# EAGLE design blinker-v2 (EAGLE 9.6.2)
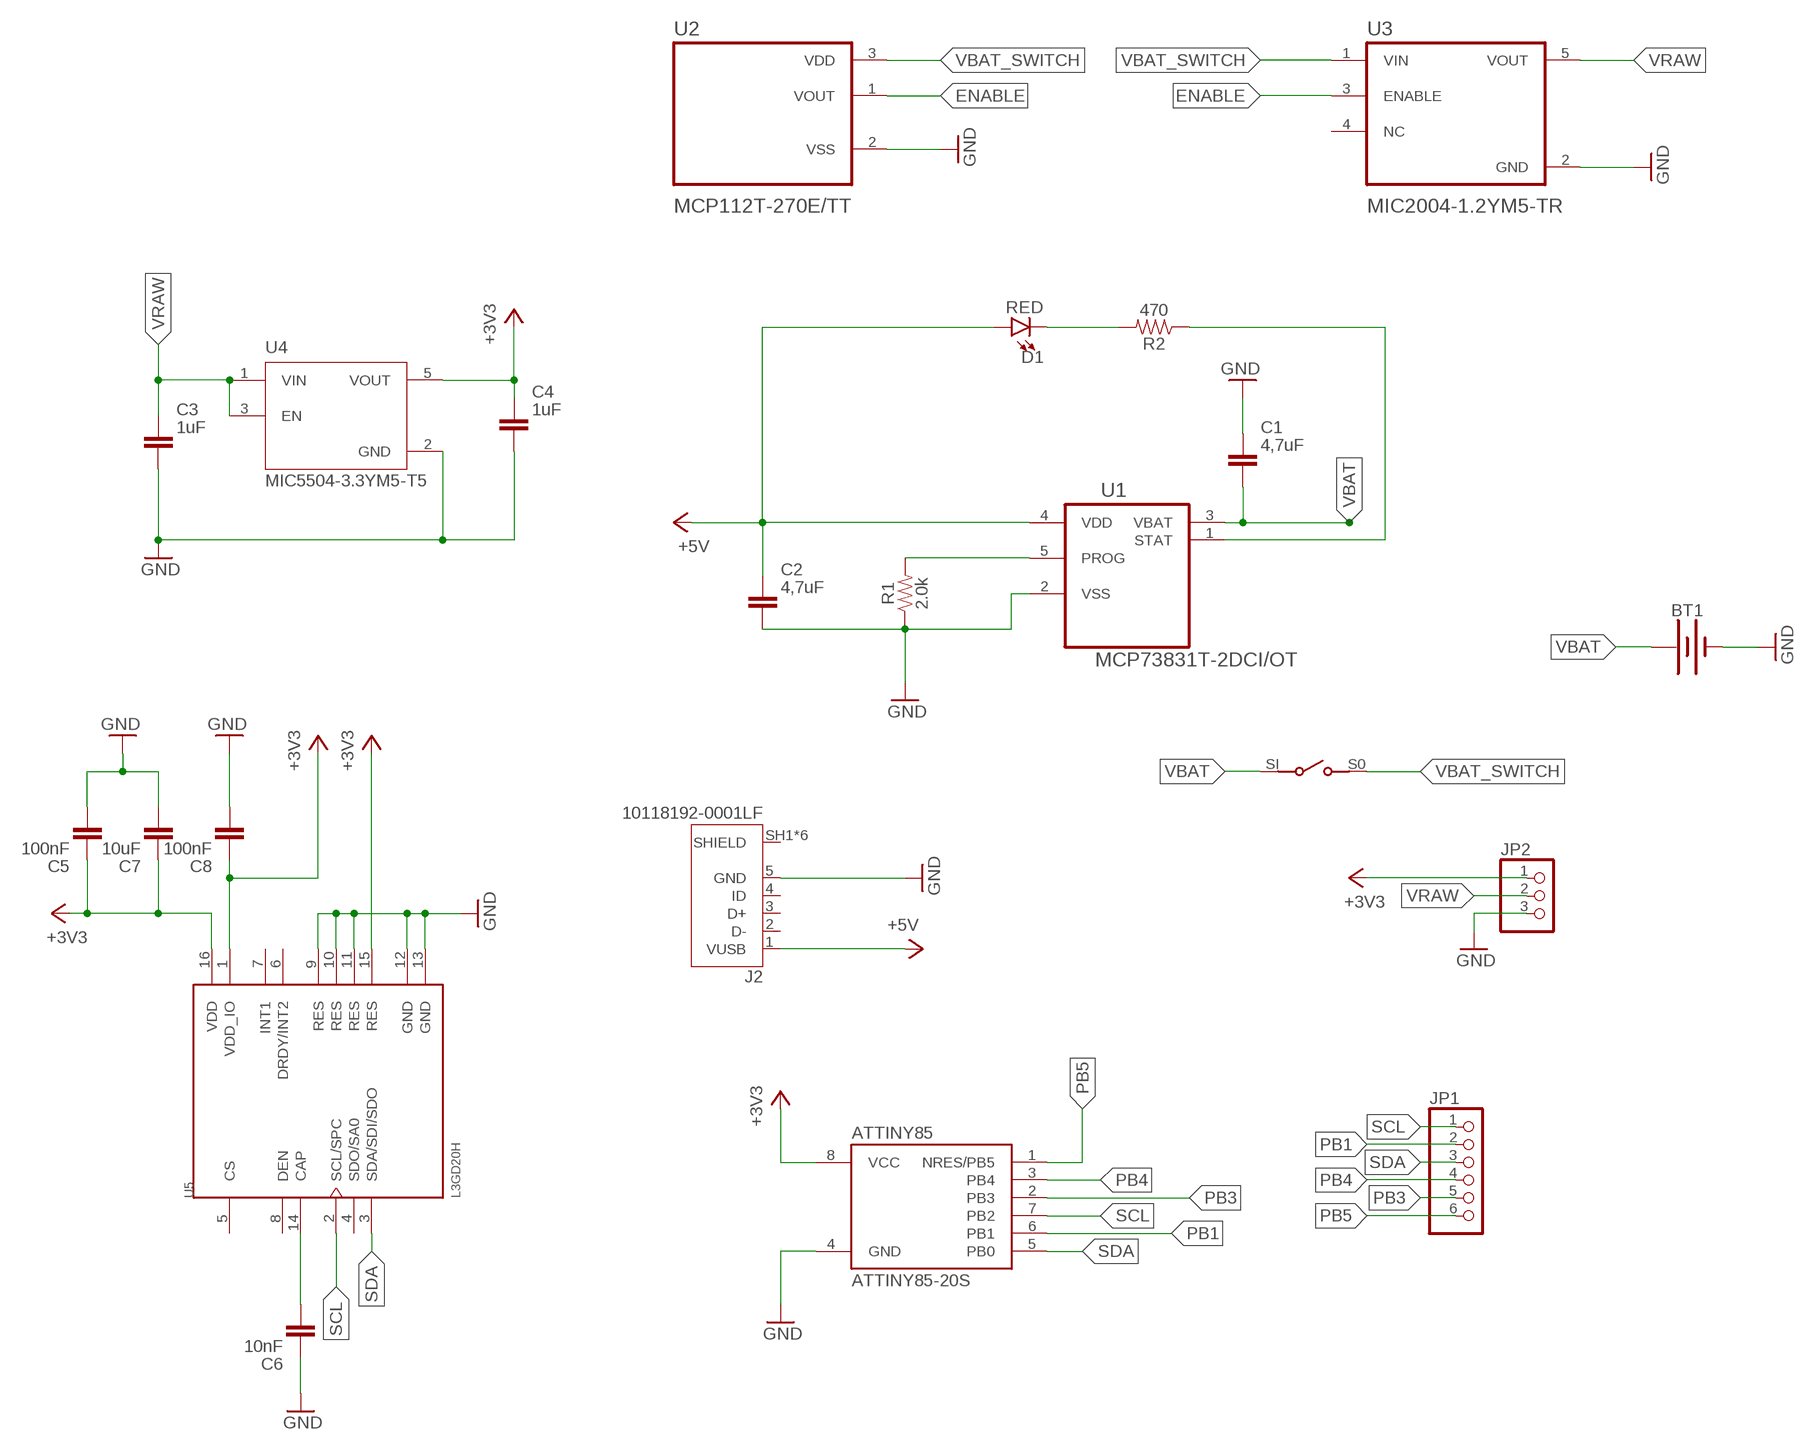
[diagram p0: schematic, sheet 1]

## Parts
ATTINY85  ATTINY85-20S  [SOIC8_EIAJ_208MIL]
BT1  BATTERY-20MM_SMD  [BATTCON_20MM]
C1  4,7uF  C_CHIP-1206(3216-METRIC)  [CAPC3216X135]
C2  4,7uF  C_CHIP-1206(3216-METRIC)  [CAPC3216X135]
C3  1uF  C_CHIP-1206(3216-METRIC)  [CAPC3216X135]
C4  1uF  C_CHIP-1206(3216-METRIC)  [CAPC3216X135]
C5  100nF  C_CHIP-1206(3216-METRIC)  [CAPC3216X135]
C6  10nF  C_CHIP-1206(3216-METRIC)  [CAPC3216X135]
C7  10uF  C_CHIP-1206(3216-METRIC)  [CAPC3216X135]
C8  100nF  C_CHIP-1206(3216-METRIC)  [CAPC3216X135]
D1  RED  LED-RED0603  [LED-0603]
J2  10118192-0001LF  [AMPHENOL_10118192-0001LF]
JP1  PINHD-1X6  [1X06]
JP2  PINHD-1X3  [1X03]
R1  2.0k  2.0KOHM-0603-1/10W-5%  [0603]
R2  470  470OHM-0603-1/10W-1%  [0603]
U1  MCP73831T-2DCI/OT  [SOT95P270X145-5N]
U2  MCP112T-270E/TT  [SOT95P237X112-3N]
U3  MIC2004-1.2YM5-TR  [SOT95P280X145-5N]
U4  MIC5504-3.3YM5-T5  [SOT95P280X145-5N]
U5  L3GD20H  [LGA16R50P7X5_300X300X100]
U$1  CHS-01TASMD  [CHS-01TA]

## Nets
+3V3: ATTINY85.8(VCC) C4.1 C5.1 C7.1 C8.1 JP2.1 U4.5(VOUT) U5.1(VDD_IO) U5.15(RES) U5.16(VDD)
+5V: C2.1 D1.A J2.1(VUSB) U1.4(VDD)
ENABLE: U2.1(VOUT) U3.3(ENABLE)
GND: ATTINY85.4(GND) BT1.2(-) C1.1 C2.2 C3.2 C4.2 C5.2 C6.1 C7.2 C8.2 J2.5(GND) JP2.3 R1.1 U1.2(VSS) U2.2(VSS) U3.2(GND) U4.2(GND) U5.9(RES) U5.10(RES) U5.11(RES) U5.12(GND) U5.13(GND)
N$1: R1.2 U1.5(PROG)
N$2: C6.2 U5.14(CAP)
N$3: D1.C R2.2
N$4: R2.1 U1.1(STAT)
PB1: ATTINY85.6(PB1) JP1.2
PB3: ATTINY85.2(PB3) JP1.5
PB4: ATTINY85.3(PB4) JP1.4
PB5: ATTINY85.1(NRES/PB5) JP1.6
SCL: ATTINY85.7(PB2) JP1.1 U5.2(SCL/SPC)
SDA: ATTINY85.5(PB0) JP1.3 U5.3(SDA/SDI/SDO)
VBAT: BT1.1(+) C1.2 U1.3(VBAT) U$1.SI(S!)
VBAT_SWITCH: U2.3(VDD) U3.1(VIN) U$1.S0(SO)
VRAW: C3.1 JP2.2 U3.5(VOUT) U4.1(VIN) U4.3(EN)
Unconnected: J2.2(D-) J2.3(D+) J2.4(ID) J2.SH1(SHIELD) J2.SH2(SHIELD) J2.SH3(SHIELD) J2.SH4(SHIELD) J2.SH5(SHIELD) J2.SH6(SHIELD) U3.4(NC) U5.4(SDO/SA0) U5.5(CS) U5.6(DRDY/INT2) U5.7(INT1) U5.8(DEN)

## Library data of the parts
ATTINY85 = _hhn_attiny25_45_85:ATTINY85*: ATMEL ATtiny 85 Packages: P = PDIP 08 30mil S = SOIC 08 EIAJ 208mil Technologies Note: for complete ordering code (temp. range, finish, tape&reel etc.) see www.atmel.com • Supply Voltage: V = (1.8…5.5)V | [blank] = (2.7…5.5)V • Speed: 10 = 10 MHz | 20 = 20 MHz Author: Dipl.-Ing. FH Rainer Bayer HHN Hochschule Heilbronn (Heilbronn University), rainer.bayer@hs-heilbronn.de Ingenieurbüro ing-rb, mail@ing-rb.de
BT1 = SparkFun-Batteries:BATTERY: Battery - Single Cell A variety of battery chemistries, sizes, and footprints. Device List: 20MM_PTH - Coin Cell Battery Holder - 20mm (PTH) <https://www.sparkfun.com/products/783> 6.8MM_PTH - Coin Cell Battery Holder - 6.8MM(SMD) <https://www.digikey.com/product-detail/en/seiko-instruments/MS621FE-FL11E/728-1057-ND/1889208?WT.srch=1&gclid=CNOQ5a6LzdQCFZS2wAodXCkE0g> 12MM_SMD - Coin Cell Battery Holder - 12mm (SMD) <https://www.sparkfun.com/products/10592> 12MM_PTH - Coin Cell Battery Holder - 12mm (PTH) <https://www.sparkfun.com/products/7948> 20MM_SMD - 20mm Coin Cell Battery Holder (SMD) (2 legs) Used on the Big Time Watch Kit <https://www.sparkfun.com/products/11734> 20MM_SMD_4LEGS - Coin Cell Battery Holder - 20mm (SMD) <https://www.sparkfun.com/products/11892> 20MM_SMD_4LEGS_OVERPASTE - Coin Cell Battery Holder - 20mm (SMD) <https://www.sparkfun.com/products/11892> (Over-paste on the legs) 24.5MM_PTH - Coin Cell Battery Holder - 24.5mm (PTH) <https://www.sparkfun.com/products/8863> 9V - 9V Battery Holder - PC Mount Used on the SparkFun SparkPunk Sound Kit <https://www.sparkfun.com/products/11177> and SparkFun SparkPunk Sequencer Kit <https://www.sparkfun.com/products/12707> 18650 - Battery Holder - 18650 (PTH) <https://www.sparkfun.com/products/13113> AA - Battery Holder - 1xAA (PTH) <https://www.sparkfun.com/products/7949> AAA - Battery Holder - 1xAAA (PTH) <https://www.sparkfun.com/products/12718> AA_KIT - Battery Holder - 1xAA (PTH) <https://www.sparkfun.com/products/7949> Special kit package - pads only have exposed copper on one side of the board. AAA_KIT - Battery Holder - 1xAAA (PTH) <https://www.sparkfun.com/products/12718> Special kit package - pads only have exposed copper on one side of the board.; PROD_ID: BATT-11519
C1 C2 = Capacitor:C: Capacitor - Generic; CATEGORY: Capacitor; DIGIKEY_PART_NR: 1276-3107-1-ND
C3-C8 = Capacitor:C: Capacitor - Generic; CATEGORY: Capacitor
D1 = SparkFun-LED:LED-RED: Red SMD LED Used in manufacturing of most products at SparkFun Packages: 0603 - SMD 0603 package [Product Link] <http://docs.avagotech.com/docs/AV02-0551EN> 0603 SMART - SMD 0603 SMART package ( more efficient and expensive)[Product Link] <http://www.osram-os.com/Graphics/XPic2/00077099_0.pdf> 1206 - SMD1206 package [Product Link] <https://www.sparkfun.com/datasheets/DevTools/LilyPad/Q150OVS4.pdff> SparkFun Products: Pro Mini 328 -5V <https://www.sparkfun.com/products/821> RedBoard <https://www.sparkfun.com/products/12757> IOIO-OTG <https://www.sparkfun.com/products/13613>; DIGIKEY_PART_NR: 732-4978-1-ND; PROD_ID: DIO-00819
J2 = 10118192-0001LF:10118192-0001LF: Single Port 5 Contact Horizontal Right Angle Shielded Micro B USB 2.0 Connector Buy Part <https://snapeda.com/parts/10118192-0001LF/Amphenol%20ICC%20%28FCI%29/view-part/?ref=eda>; ARROW_ELECTRONICS-PURCHASE-URL: https://snapeda.com/shop?store=Arrow+Electronics&id=4793801; AVAILABILITY: Good; DESCRIPTION: USB - micro B USB 2.0 Receptacle Connector 5 Position Surface Mount, Right Angle; DIGIKEY-PURCHASE-URL: https://snapeda.com/shop?store=DigiKey&id=4793801; MF: Amphenol ICC (FCI); MOUSER-PURCHASE-URL: https://snapeda.com/shop?store=Mouser&id=4793801; MP: 10118192-0001LF; PACKAGE: None; PRICE: None
JP1 = pinhead:PINHD-1X6: PIN HEADER
JP2 = pinhead:PINHD-1X3: PIN HEADER
R1 = SparkFun-Resistors:2.0KOHM: 2kΩ resistor A resistor is a passive two-terminal electrical component that implements electrical resistance as a circuit element. Resistors act to reduce current flow, and, at the same time, act to lower voltage levels within circuits. - Wikipedia; DIGIKEY_PART_NR: RMCF0201FT2K00CT-ND; PROD_ID: RES-08296
R2 = SparkFun-Resistors:470OHM: 470Ω resistor A resistor is a passive two-terminal electrical component that implements electrical resistance as a circuit element. Resistors act to reduce current flow, and, at the same time, act to lower voltage levels within circuits. - Wikipedia; DIGIKEY_PART_NR: YAG2689CT-ND; PROD_ID: RES-07869
U1 = MCP73831T-2DCI_OT:MCP73831T-2DCI/OT: Li-Polymer Charge Management Controllers, SOT23-5 Buy Part <https://snapeda.com/parts/MCP73831T-2DCI/OT/Microchip/view-part/?ref=eda>; AVAILABILITY: Good; DESCRIPTION: Charger IC Lithium Ion/Polymer SOT-23-5; DIGIKEY-PURCHASE-URL: https://snapeda.com/shop?store=DigiKey&id=43759; MF: Microchip; MOUSER-PURCHASE-URL: https://snapeda.com/shop?store=Mouser&id=43759; MP: MCP73831T-2DCI/OT; PACKAGE: SOT-23-5 Microchip; PRICE: None
U2 = MCP112T-270E_TT:MCP112T-270E/TT: None Buy Part <https://snapeda.com/parts/MCP112T-270E/TT/Microchip/view-part/?ref=eda>; ARROW_ELECTRONICS-PURCHASE-URL: https://snapeda.com/shop?store=Arrow+Electronics&id=142363; AVAILABILITY: Good; DESCRIPTION: Supervisor Push-Pull, Totem Pole 1 Channel SOT-23-3; MF: Microchip; MOUSER-PURCHASE-URL: https://snapeda.com/shop?store=Mouser&id=142363; MP: MCP112T-270E/TT; PACKAGE: SOT-23 Microchip; PRICE: None
U3 = MIC2004-1.2YM5-TR:MIC2004-1.2YM5-TR: None Buy Part <https://snapeda.com/parts/MIC2004-1.2YM5-TR/Microchip/view-part/?ref=eda>; AVAILABILITY: Warning; DESCRIPTION: Power Switch/Driver 1:1 P-Channel 1.2A SOT-23-5; MF: Microchip; MOUSER-PURCHASE-URL: https://snapeda.com/shop?store=Mouser&id=1216368; MP: MIC2004-1.2YM5-TR; PACKAGE: SOT-23 Microchip; PRICE: None
U4 = MIC5504-3.3YM5-T5:MIC5504-3.3YM5-T5: Linear Voltage Regulator IC 1 Output 300mA SOT-23-5 Buy Part <https://snapeda.com/parts/MIC5504-3.3YM5-T5/Microchip/view-part/?ref=eda>; ARROW_ELECTRONICS-PURCHASE-URL: https://snapeda.com/shop?store=Arrow+Electronics&id=1219468; AVAILABILITY: Good; DESCRIPTION: Linear Voltage Regulator IC 1 Output 300mA SOT-23-5; DIGIKEY-PURCHASE-URL: https://snapeda.com/shop?store=DigiKey&id=1219468; MF: Microchip; MOUSER-PURCHASE-URL: https://snapeda.com/shop?store=Mouser&id=1219468; MP: MIC5504-3.3YM5-T5; PACKAGE: SOT-23-5 Microchip; PRICE: None
U5 = L3GD20H:L3GD20H: MEMS motion sensor: three-axis digital output gyroscope Buy Part <https://snapeda.com/parts/L3GD20H/STMicroelectronics/view-part/?ref=eda>; AVAILABILITY: Bad; DESCRIPTION: Gyroscope X (Pitch), Y (Roll), Z (Yaw) ±245, 500, 2000 6.25Hz ~ 400Hz I²C, SPI 16-LGA (3x3); MF: STMicroelectronics; MP: L3GD20H; PACKAGE: LGA-16 STMicroelectronics; PRICE: None
U$1 = CHS-01TA:CHS-01TA: Buy Part <https://snapeda.com/parts/CHS-01TA/Nidec%20Copal/view-part/?ref=eda>; AVAILABILITY: Warning; DESCRIPTION: Dip Switch SPST 1 Position Surface Mount Slide (Standard) Actuator 100mA 6VDC; DIGIKEY-PURCHASE-URL: https://snapeda.com/shop?store=DigiKey&id=2873101; MF: Nidec Copal; MOUSER-PURCHASE-URL: https://snapeda.com/shop?store=Mouser&id=2873101; MP: CHS-01TA; PACKAGE: None; PRICE: None

## Board
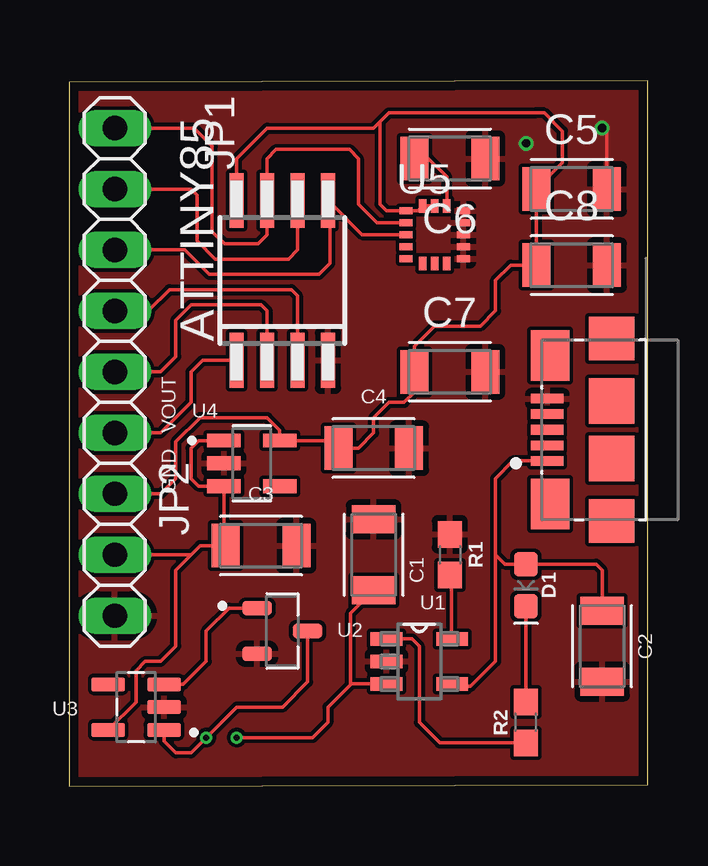
[diagram p1: board, top side]
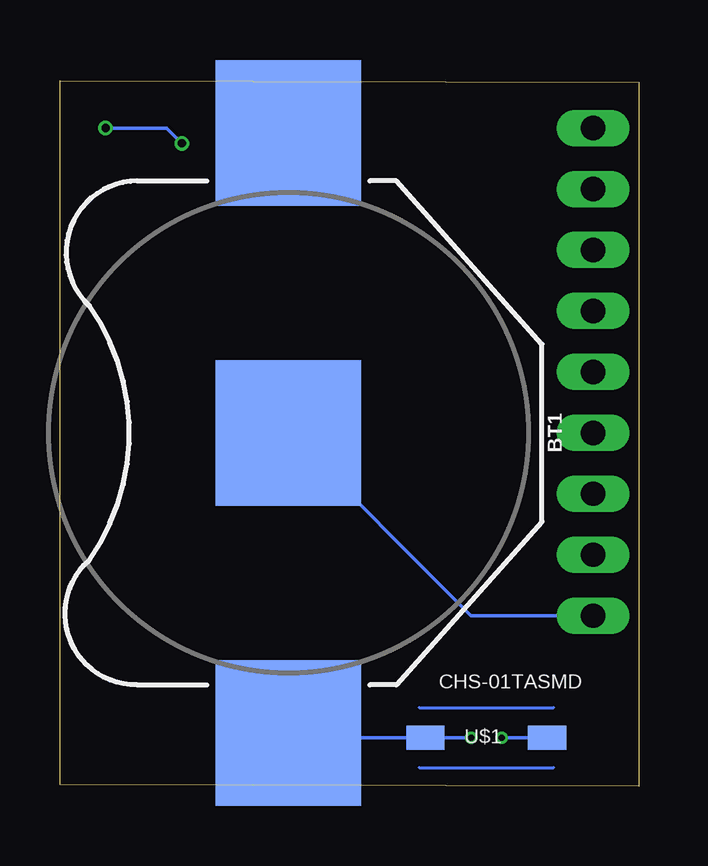
[diagram p2: board, bottom side, seen from below]

Size 24.13 x 29.4 mm. Coordinates in mm from the lower left corner, seen from the top.
Outline: 0,0 24.13,0.07 24.13,29.4 0,29.34 0,0
Copper layers (1*16): Top 0.035559375mm / dielectric 1.6mm / Bottom 0.035559375mm
Design rules "oshpark-2layer": minimum track width 6mil, minimum drill 10mil, track to track 6mil, track to pad 6mil, pad to pad 6mil, via to via 6mil, smd to smd 6mil, copper to edge 15mil, drill to drill 6mil, minimum pad ring 5mil, minimum via ring 5mil, stop-mask expansion 2.5mil, vias tented up to drill 0mil, thermal gap 10mil

### Footprints (pad centres in the part's own frame; a part is rotated, then mirrored left to right if it is on the bottom)
SOIC8_EIAJ_208MIL = smd 0.6 x 2.286: 1 -1.905,-3.33; 2 -0.635,-3.33; 3 0.635,-3.33; 4 1.905,-3.33; 5 1.905,3.33; 6 0.635,3.33; 7 -0.635,3.33; 8 -1.905,3.33
BATTCON_20MM = smd 6.07 x 6.07: 1 -12.5,0; 2 0,0; 3 12.5,0
CAPC3216X135 = smd 1.165 x 1.815: 1 -1.475,0; 2 1.475,0
LED-0603 = smd 1 x 1: A -0.877,0; C 0.877,0
AMPHENOL_10118192-0001LF = smd 0.4 x 1.35: 1 -1.3,0; 2 -0.65,0; 3 0,0; 4 0.65,0; 5 1.3,0 | smd 2.1 x 1.6: SH1 -3.1,-0.125; SH2 3.1,-0.125 | smd 1.8 x 1.9: SH3 -3.8,-2.675; SH6 3.8,-2.675 | smd 1.9 x 1.9: SH4 -1.2,-2.675; SH5 1.2,-2.675
1X06 = drill 1.016 long: 1 -6.35,0; 2 -3.81,0; 3 -1.27,0; 4 1.27,0; 5 3.81,0; 6 6.35,0
1X03 = drill 1.016 long: 1 -2.54,0; 2 0,0; 3 2.54,0
0603 = smd 1.1 x 1: 1 -0.85,0; 2 0.85,0
SOT95P270X145-5N = smd 1.321 x 0.559: 1 -1.372,0.94; 2 -1.372,0; 3 -1.372,-0.94; 4 1.372,-0.94; 5 1.372,0.94
SOT95P237X112-3N = smd 1.24 x 0.59: 1 -1.055,0.95; 2 -1.055,-0.95; 3 1.055,0
SOT95P280X145-5N = smd 1.39 x 0.58: 1 -1.165,0.95; 2 -1.165,0; 3 -1.165,-0.95; 4 1.165,-0.95; 5 1.165,0.95
LGA16R50P7X5_300X300X100 = smd 0.55 x 0.3: 1 -1.2,1; 2 -1.2,0.5; 3 -1.2,0; 4 -1.2,-0.5; 5 -1.2,-1; 9 1.2,-1; 10 1.2,-0.5; 11 1.2,0; 12 1.2,0.5; 13 1.2,1 | smd 0.3 x 0.55: 6 -0.5,-1.2; 7 0,-1.2; 8 0.5,-1.2; 14 0.5,1.2; 15 0,1.2; 16 -0.5,1.2
CHS-01TA = smd 1 x 1.6: S0 0,-2.54; SI 0,2.54

### Placement (x,y rotation side)
ATTINY85  8.89,21.08 0 top
BT1  14.6,14.73 90 bottom
C1  12.7,9.65 270 top
C2  22.23,5.84 270 top
C3  8,10.03 0 top
C4  12.7,14.1 0 top
C5  20.95,24.89 0 top
C6  15.88,26.16 180 top
C7  15.88,17.27 0 top
C8  20.95,21.72 0 top
D1  19.05,8.38 270 top
J2  19.94,14.86 90 top
JP1  1.91,21.08 270 top
JP2  1.91,9.65 270 top
R1  15.88,9.65 270 top
R2  19.05,2.67 90 top
U1  14.6,5.21 0 top
U2  8.89,6.48 0 top
U3  2.79,3.3 180 top
U4  7.62,13.46 0 top
U5  15.24,22.99 0 top
U$1  6.35,2.03 90 bottom

### Tracks (layer width: path | path; a pad name or v marks a point on that pad's centre or on a via)
+3V3
  Top 0.152: U5.15 U5.16 14.54,23.99 U5.1 13.22,23.99 12.95,24.26 12.95,27.69 | 12.95,27.69 13.34,28.07 19.05,28.07 19.43,28.07 19.81,28.07 20.57,27.3 20.57,25.99 C5.1 C8.1 18.41,21.72 17.78,21.08 17.78,19.81 17.15,19.18 15.24,19.18 14.4,18.34 C7.1 14.4,16.43 13.97,16 13.34,16 12.7,15.37 12.7,14.73 12.06,14.1 C4.1 10.91,14.41 U4.5 8.79,14.84 8.25,15.37 5.46,15.37 4.45,14.35 4.45,12.83 3.81,12.19 JP2.1 | ATTINY85.8 6.98,26.16 8.25,27.43 12.7,27.43 12.95,27.69
+5V
  Top 0.152: U1.4 16.05,4.17 16.74,4.17 17.78,5.21 17.78,9.65 | J2.1 18.51,13.56 17.78,12.83 17.78,9.65 | 17.78,9.65 18.17,9.26 D1.A 21.98,9.26 22.23,9.02 C2.1
ENABLE
  Top 0.152: U3.3 4.76,4.25 5.71,5.21 5.71,6.48 6.66,7.43 U2.1
GND  (via drill 0.35)
  Top 0.152: C5.2 22.43,27.23 v22.23,27.43
  Bottom 0.152: JP2.3 6.98,7.11 BT1.2 | v22.23,27.43 19.69,27.43 v19.05,26.8
  pour Top: 0,29.97 0,-0.51 25.4,-0.51 25.4,29.97
N$1
  Top 0.152: U1.5 15.95,6.17 15.95,8.74 R1.2
N$2
  Top 0.152: U5.14 15.75,25.4 14.99,26.16 C6.2
N$3
  Top 0.152: D1.C R2.2
N$4
  Top 0.152: U1.1 14.3,6.15 14.6,5.84 14.6,2.67 15.45,1.82 R2.1
PB1
  Top 0.152: JP1.2 5.08,24.89 5.33,24.64 5.33,22.73 6.1,21.97 9.14,21.97 9.52,22.35 ATTINY85.6
PB3
  Top 0.152: JP1.5 3.81,17.27 4.45,17.91 4.45,19.43 5.08,20.07 8,20.07 8.25,19.81 ATTINY85.2
PB4
  Top 0.152: JP1.4 3.3,19.81 4.19,20.7 9.27,20.7 9.52,20.45 ATTINY85.3
PB5
  Top 0.152: JP1.6 3.81,14.73 5.08,16 5.08,17.27 5.56,17.75 ATTINY85.1
SCL
  Top 0.152: U5.2 12.84,23.49 12.06,24.26 12.06,26.16 11.68,26.54 8.64,26.54 8.25,26.16 ATTINY85.7 8.25,22.99 7.87,22.61 6.48,22.61 5.97,23.11 5.97,26.67 5.21,27.43 JP1.1
SDA
  Top 0.152: ATTINY85.5 10.87,24.33 | 10.87,24.33 12.22,22.99 U5.3 | 10.87,24.33 10.87,21.79 10.41,21.34 5.84,21.34 4.83,22.35 JP1.3
VBAT  (via drill 0.25)
  Top 0.152: U1.3 11.73,4.27 | 11.73,4.27 11.73,4.24 10.79,3.3 10.79,2.67 10.16,2.03 v6.98,2.03 | 11.73,4.27 11.73,7.21 C1.2
  Bottom 0.152: BT1.1 14.58,2.18 14.43,2.03 U$1.SI v6.98,2.03
VBAT_SWITCH  (via drill 0.25)
  Top 0.152: U2.3 9.95,4.36 8.89,3.3 6.98,3.3 v5.71,2.03 5.08,1.4 4.45,1.4 3.96,1.88 U3.1
  Bottom 0.152: v5.71,2.03 U$1.S0
VRAW
  Top 0.152: U4.1 5.39,14.41 5.08,14.1 5.08,12.83 5.39,12.51 U4.3 6.45,10.1 C3.1 5.46,10.03 5.08,9.65 | 5.08,9.65 JP2.2 | U3.5 2.79,3.52 2.79,4.83 3.18,5.21 3.81,5.21 4.45,5.84 4.45,9.02 5.08,9.65

### Text on the board
tNames: VOUT | GND